# Altium project 4sLipoIndicator.PrjPcb
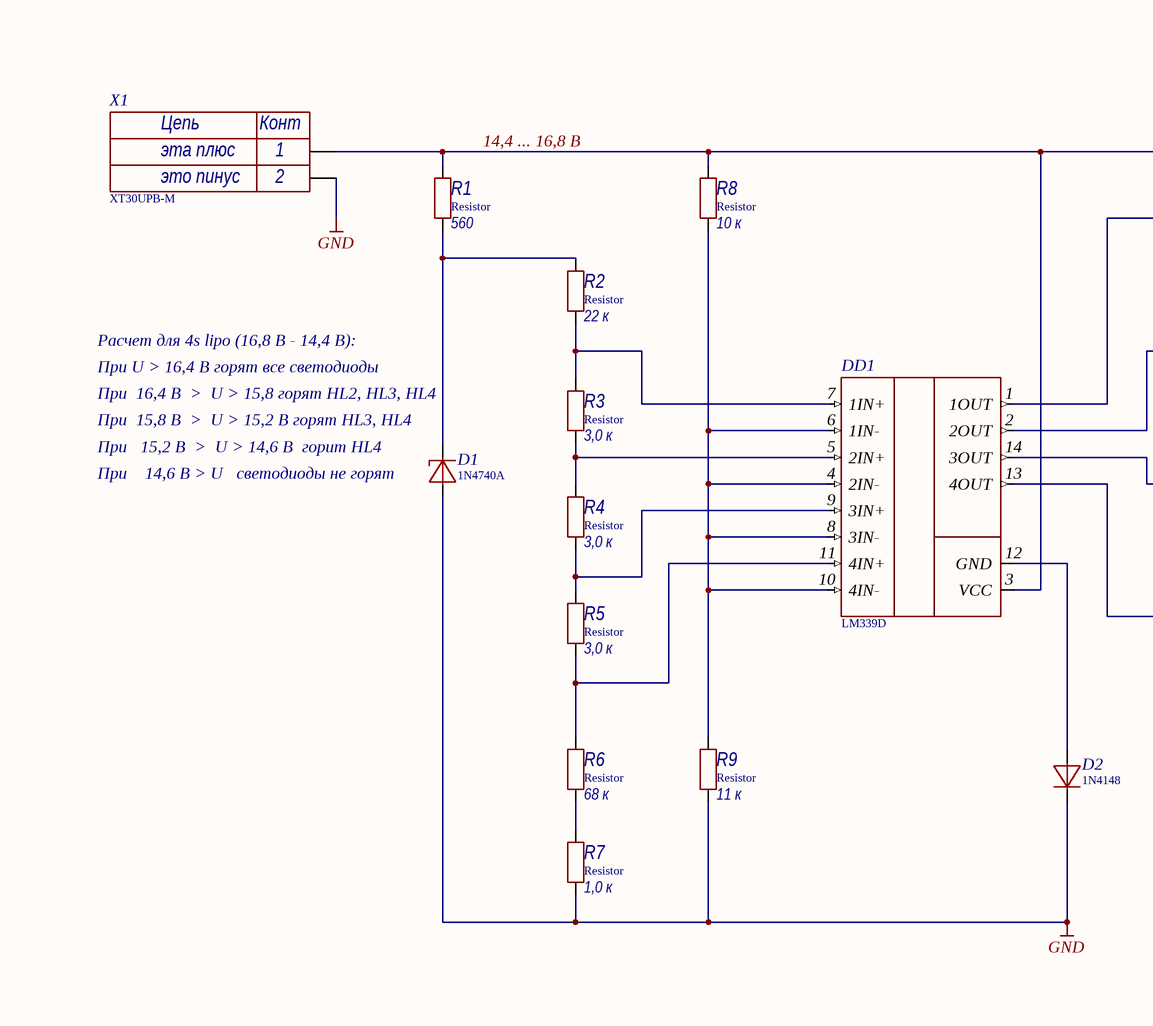
[diagram p0: Sheet1.SchDoc, left]
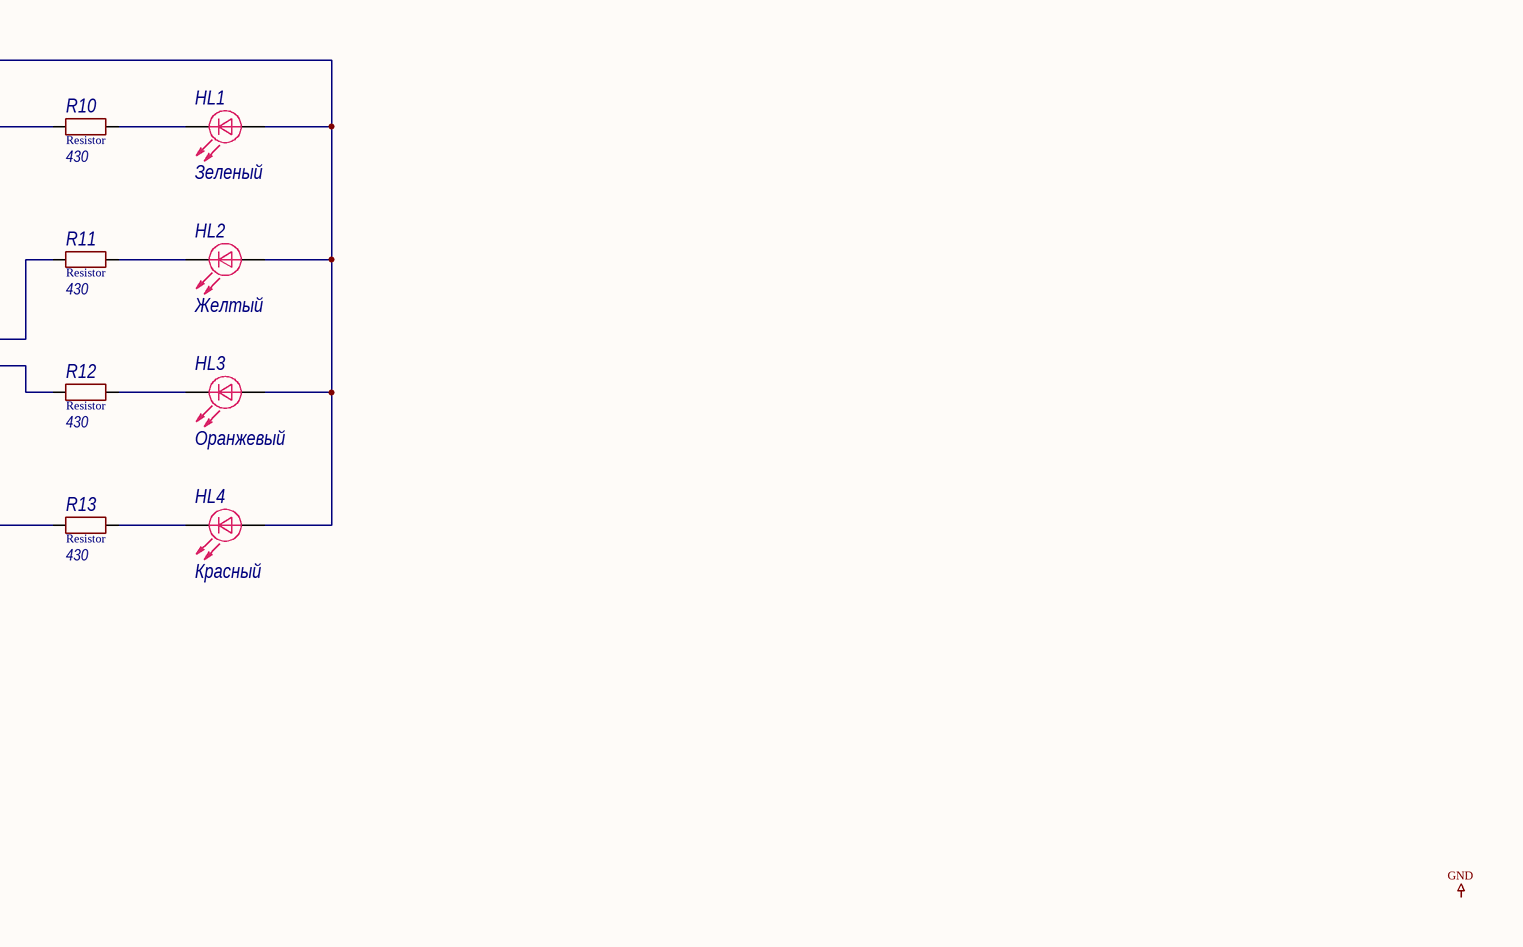
[diagram p1: Sheet1.SchDoc, right]
1 sheet, 21 parts. Net scope: global (net labels, ports and power ports of the same name join across sheets).
Board file: PCB1.PcbDoc

## Sheet Sheet1.SchDoc
size A4; SheetNumber: 1; SheetTotal: 1

### Parts
D1  1N4740A  [DIOAD1060W70L435D230]
D2  1N4148  [DIOAD753W49L380D172B]
DD1  LM339D  [SOIC127P600X175-14N]
HL1  Color: Зеленый  [0805D]  (hidden comment: LED)
HL2  Color: Желтый  [0805D]  (hidden comment: LED)
HL3  Color: Оранжевый  [0805D]  (hidden comment: LED)
HL4  Color: Красный  [0805D]  (hidden comment: LED)
R1  Resistor  value 560  [0603R]
R2  Resistor  value 22 к  [0603R]
R3  Resistor  value 3,0 к  [0603R]
R4  Resistor  value 3,0 к  [0603R]
R5  Resistor  value 3,0 к  [0603R]
R6  Resistor  value 68 к  [0603R]
R7  Resistor  value 1,0 к  [0603R]
R8  Resistor  value 10 к  [0603R]
R9  Resistor  value 11 к  [0603R]
R10  Resistor  value 430  [0603R]
R11  Resistor  value 430  [0603R]
R12  Resistor  value 430  [0603R]
R13  Resistor  value 430  [0603R]
X1  XT30UPB-M  Value2: это пинус  Value1: эта плюс  [XT30UPB-M]

### Nets
GND: D1.A D2.K R7.1 R9.1 X1.N
14,4 ... 16,8 В: DD1.3(VCC) HL1.1 HL2.1 HL3.1 HL4.1 R1.2 R8.2 X1.P
NetD1_C: D1.C(K) R1.1 R2.2
NetD2_A: D2.A DD1.12(GND)
NetDD1_1: DD1.1(1OUT) R10.1
NetDD1_2: DD1.2(2OUT) R11.1
NetDD1_4: DD1.4(2IN-) DD1.6(1IN-) DD1.8(3IN-) DD1.10(4IN-) R8.1 R9.2
NetDD1_5: DD1.5(2IN+) R3.1 R4.2
NetDD1_7: DD1.7(1IN+) R2.1 R3.2
NetDD1_9: DD1.9(3IN+) R4.1 R5.2
NetDD1_11: DD1.11(4IN+) R5.1 R6.2
NetDD1_13: DD1.13(4OUT) R13.1
NetDD1_14: DD1.14(3OUT) R12.1
NetHL1_2: HL1.2 R10.2
NetHL2_2: HL2.2 R11.2
NetHL3_2: HL3.2 R12.2
NetHL4_2: HL4.2 R13.2
NetR6_1: R6.1 R7.2

### Notes on the sheet
- Расчет для 4s lipo (16,8 В - 14,4 В):
- При U > 16,4 В горят все светодиоды
- (near D1) При  16,4 В  >  U > 15,8 горят HL2, HL3, HL4
- (near D1) При  15,8 В  >  U > 15,2 В горят HL3, HL4
- (near D1) При   15,2 В  >  U > 14,6 В  горит HL4
- (near D1) При    14,6 В > U   светодиоды не горят
- Labels drawn without touching a wire or pin: GND
- (in symbol XT30UPB-M) Цепь; Конт; 1; 2

### Library data of the parts
D1 = 1N4740A: диод Зенера 10 В; Value: 10 В; MF: Vishay Semiconductor; MP: 1N4740A-TR; Voltage nominal (V): 10; Current nominal (mA): 25; Power (W): 1; Accuracy: 0,05; SnapEDA_Link: https://www.snapeda.com/parts/1N4740A-TR/Vishay/view-part/?ref=snap; Package: DO-41 Vishay Semiconductor; Check_prices: https://www.snapeda.com/parts/1N4740A-TR/Vishay/view-part/?ref=eda; Part Number: 1N4740A
D2 = 1N4148: диод; MF: ON Semiconductor; SnapEDA_Link: https://www.snapeda.com/parts/1N4148/Onsemi/view-part/?ref=snap; Package: AXIAL LEAD-2 ON Semiconductor; Value: *; MP: 1N4148; Check_prices: https://www.snapeda.com/parts/1N4148/Onsemi/view-part/?ref=eda; Part Number: 1N4148
DD1 = LM339D: 4 компаратора; MF: Texas Instruments; SnapEDA_Link: https://www.snapeda.com/parts/LM339D/Texas+Instruments/view-part/?ref=snap; Package: SOIC-14 Texas Instruments; Value: *; MP: LM339D; Check_prices: https://www.snapeda.com/parts/LM339D/Texas+Instruments/view-part/?ref=eda; Part Number: LM339D
HL1-HL4 = LED: Светодиод; Part Number: LED
R1 = Resistor_560_1_0603: Резистор номиналом 560 Ом и точностью 1%; Power: *; Part Number: Resistor_560_1_0603; Tolerance: 1%
R2 = Resistor_22k_1_0603: Резистор номиналом 22 кОм и точностью 1%; Power: *; Part Number: Resistor_22k_1_0603; Tolerance: 1%
R3-R5 = Resistor_3.0k_1_0603: Резистор номиналом 3,0 кОм и точностью 1%; Power: *; Part Number: Resistor_3.0k_1_0603; Tolerance: 1%
R6 = Resistor_68k_1_0603: Резистор номиналом 68 кОм и точностью 1%; Power: *; Part Number: Resistor_68k_1_0603; Tolerance: 1%
R7 = Resistor_1.0k_1_0603: Резистор номиналом 1,0 кОм и точностью 1%; Power: *; Part Number: Resistor_1.0k_1_0603; Tolerance: 1%
R8 = Resistor_10k_1_0603: Резистор номиналом 10 кОм и точностью 1%; Power: *; Part Number: Resistor_10k_1_0603; Tolerance: 1%
R9 = Resistor_11k_1_0603: Резистор номиналом 11 кОм и точностью 1%; Power: *; Part Number: Resistor_11k_1_0603; Tolerance: 1%
R10-R13 = Resistor_430_1_0603: Резистор номиналом 430 Ом и точностью 1%; Power: *; Part Number: Resistor_430_1_0603; Tolerance: 1%
X1 = XT30UPB-M: 2-пиновый разъем с ключом; Part Number: XT30UPB-M